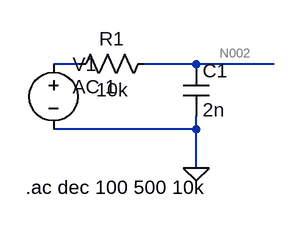
[diagram p0: schematic RC-generate.asc]
RC-generate.asc, the LTspice schematic file:
Version 4
SHEET 1 880 680
WIRE 64 192 32 192
WIRE 208 192 144 192
WIRE 304 192 208 192
WIRE 208 272 208 256
WIRE 208 272 32 272
WIRE 208 320 208 272
FLAG 208 320 0
SYMBOL res 160 176 R90
WINDOW 0 0 56 VBottom 2
WINDOW 3 32 56 VTop 2
SYMATTR InstName R1
SYMATTR Value 10k
SYMATTR SpiceLine tol=5 pwr=0.250
SYMBOL voltage 32 176 R0
WINDOW 3 24 96 Invisible 2
WINDOW 123 24 44 Left 2
WINDOW 39 0 0 Left 2
SYMATTR Value SINE(0 1 7.5k 0 0 0 0)
SYMATTR Value2 AC 1
SYMATTR InstName V1
SYMBOL cap 192 192 R0
SYMATTR InstName C1
SYMATTR Value 2n
TEXT -2 344 Left 2 !.ac dec 100 500 10k

The netlist it stands for:
* RC-generate.asc
R1 N002 N001 10k tol=5 pwr=0.250
V1 N001 0 SINE(0 1 7.5k 0 0 0 0) AC 1
C1 N002 0 2n
.ac dec 100 500 10k
.backanno
.end

* Results of the author's LTspice run, read from the files saved beside the schematic
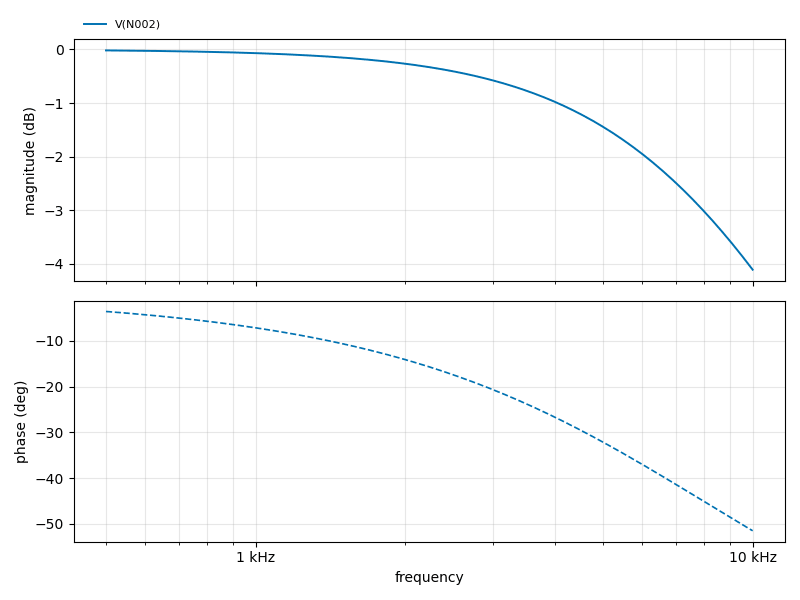
[diagram p1: AC Analysis of RC-generate.asc, plotted from the saved traces]
* AC Analysis, 1 run:
*   V(N002): -0.02 dB at 500 Hz, -4.11 dB at 10 kHz, peak -0.02 dB at 500 Hz, 3 dB below the peak at 7.989 kHz